# Altium schematic sheet 3.3V.schdoc
size 336 x 132 mm; SheetNumber: 1; SheetTotal: 5
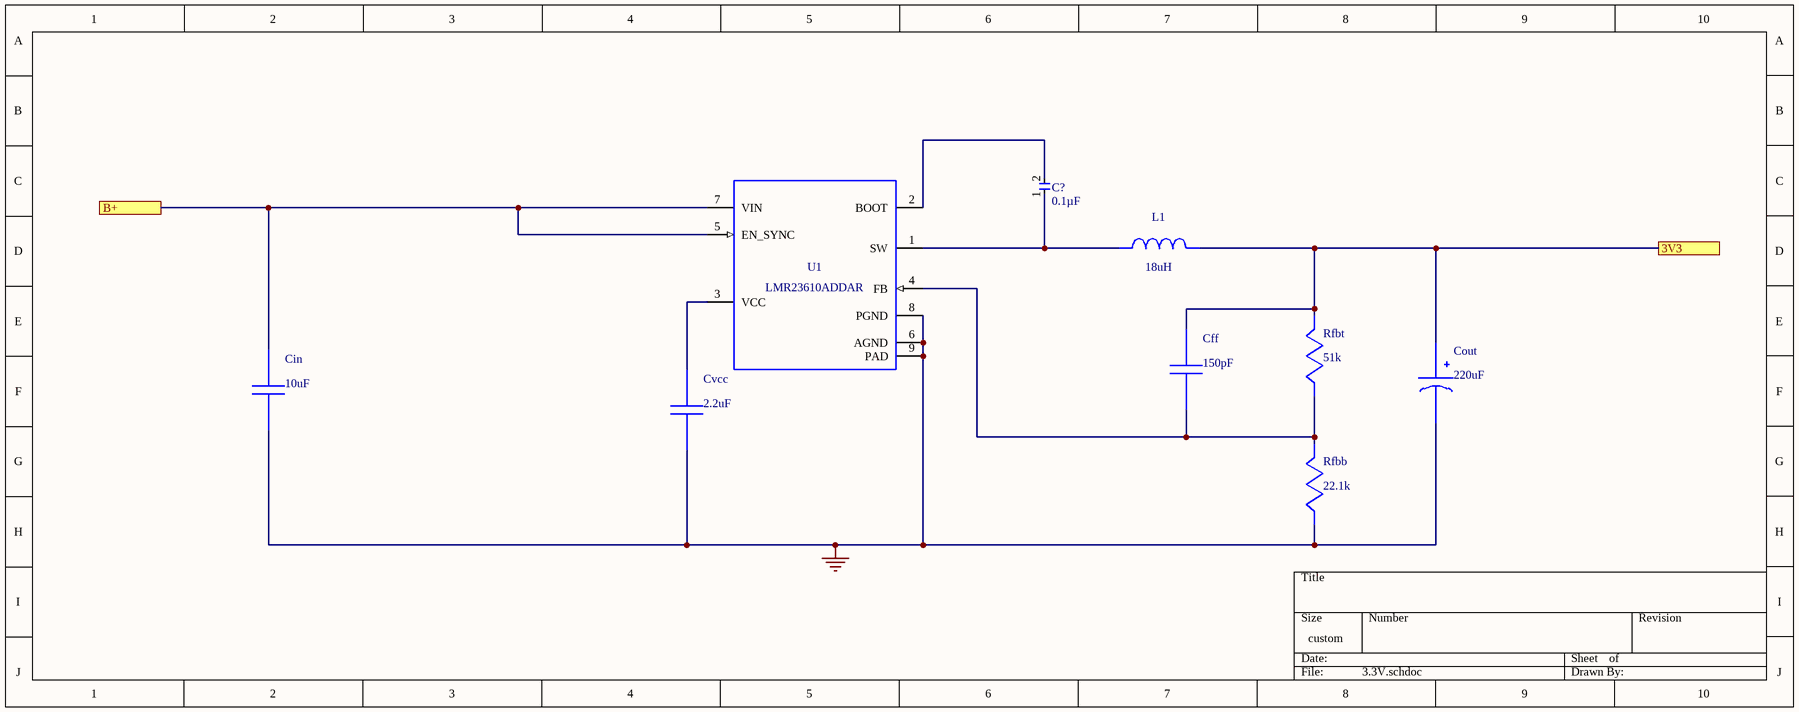
[diagram p0: 3.3V.schdoc]

## Parts
C?  0.1µF
Cff  value 150pF  (hidden comment: 250R07N151JV4T)
Cin  value 10uF  (hidden comment: C3225X7R1H106M250AC)
Cout  value 220uF  (hidden comment: 6SVPE220MW)
Cvcc  value 2.2uF  (hidden comment: C0603C225K8PACTU)
L1  value 18uH  (hidden comment: NPI54C180MTRF)
Rfbb  value 22.1k  (hidden comment: CRCW040222K1FKED)
Rfbt  value 51k  (hidden comment: RC0603FR-0751KL)
U1  LMR23610ADDAR

## Ports
3V3, B+

## Nets
0: Cin.2 Cout.2(-) Cvcc.2 Rfbb.2 U1.6(AGND) U1.8(PGND) U1.9(PAD)
3V3: Cff.1 Cout.1(+) L1.2 Rfbt.1 ; port 3V3
B+: Cin.1 U1.5(EN_SYNC) U1.7(VIN) ; port B+
NetC?_1: C?.1 L1.1 U1.1(SW)
NetC?_2: C?.2 U1.2(BOOT)
NetCff_2: Cff.2 Rfbb.1 Rfbt.2 U1.4(FB)
NetCvcc_1: Cvcc.1 U1.3(VCC)

## Library data of the parts
C? = C0805C104K5RACTU: Cap Ceramic 0.1uF 50V X7R 10% SMD 2.0 x 1.2 mm 125 C Paper T/R; Manufacturer: KEMET; Capacitance: 100nF; Voltage: 500V; Supplier 1: Farnell; Manufacturer Part Number: C0805C104K5RACTU; RoHS: Yes; Category: Ceramic Capacitors; Stock 1: 148517; Pricing 1: 10=0,07810, 100=0,05810, 500=0,03910, 1000=0,03450, 2000=0,03090 (GBP); Mount: Surface Mount,PCB; Case/Package: 0805; Number of Pins: 2; Case Code (Imperial): 0805; Case Code (Metric): 2012; Contact Plating: Tin,Matte; Dielectric Material: Ceramic; Min Operating Temperature: -55°C; Max Operating Temperature: 125°C; Tolerance: 10%; Dielectric: X7R; Package Quantity: 4000; Voltage Rating: 50V; Packaging: Tape and Reel; Voltage Rating (DC): 50V; Termination: SMD/SMT; Series: C0805C; Construction: Flat; Length: 2mm; Width: 1.2mm; Height: 0.9mm; Depth: 1.25mm; Lead Pitch: 0.75mm; Thickness: 0.035inch; Radiation Hardening: No; RoHS Compliant: Yes; REACH SVHC: No SVHC; ComponentLink1URL: https://datasheet.ciiva.com/14589/70095383-14589048.pdf?src-supplier=Allied+Electronics; ComponentLink1Description: https://datasheet.ciiva.com/14589/70095383-14589048.pdf?src-supplier=Allied+Electronics; ComponentLink2URL: https://datasheet.ciiva.com/28682/1851736-28682232.pdf?src-supplier=Element14; ComponentLink2Description: https://datasheet.ciiva.com/28682/1851736-28682232.pdf?src-supplier=Element14; ComponentLink3URL: https://datasheet.ciiva.com/32431/slceramic-chip-condensers-e-32431755.pdf?src-supplier=Distrelec; ComponentLink3Description: https://datasheet.ciiva.com/32431/slceramic-chip-condensers-e-32431755.pdf?src-supplier=Distrelec; ComponentLink4URL: https://datasheet.ciiva.com/18410/70095383-18410815.pdf?src-supplier=Allied+Electronics; ComponentLink4Description: https://datasheet.ciiva.com/18410/70095383-18410815.pdf?src-supplier=Allied+Electronics; Supplier Part Number 1: 1414664
Cff = 250R07N151JV4T: Manufacturer Name: Johanson Technology; PackageReference: 250R07N151JV4T; Manufacturer Part Number: 250R07N151JV4T
Cin = C3225X7R1H106M250AC: C3225X7R1H106M25; Manufacturer Name: TDK; PackageReference: C3225X7R1H106M250AC; Manufacturer Part Number: C3225X7R1H106M250AC
Cout = 6SVPE220MW: Manufacturer Name: Panasonic; PackageReference: 6SVPE220MW; Manufacturer Part Number: 6SVPE220MW
Cvcc = C0603C225K8PACTU: Manufacturer Name: Kemet; PackageReference: C0603C225K8PACTU; Manufacturer Part Number: C0603C225K8PACTU
L1 = NPI54C180MTRF: Manufacturer Name: NIC Components; PackageReference: NPI54C180MTRF; Manufacturer Part Number: NPI54C180MTRF
Rfbb = CRCW040222K1FKED: Manufacturer Name: Vishay-Dale; PackageReference: CRCW040222K1FKED; Manufacturer Part Number: CRCW040222K1FKED
Rfbt = RC0603FR-0751KL: Manufacturer Name: Yageo; PackageReference: RC0603FR-0751KL; Manufacturer Part Number: RC0603FR-0751KL
U1 = LMR23610ADDAR: Manufacturer Name: Texas Instruments; PackageReference: LMR23610ADDAR; Manufacturer Part Number: LMR23610ADDAR; Value: N/A